# Altium project Powerman.PrjPcb
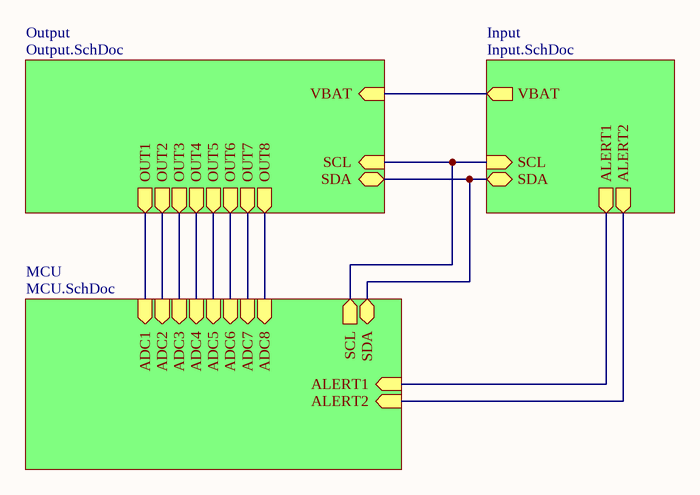
[diagram p0: POWERMAN.SchDoc]
4 sheets, 116 parts. Net scope: hierarchical (ports join the sheet entries above them; power ports are global).
Board file: PCB1.PcbDoc
Sheets:
  POWERMAN.SchDoc
    MCU = MCU.SchDoc
    Output = Output.SchDoc
    Input = Input.SchDoc

## Sheet POWERMAN.SchDoc
size A4; SheetNumber: 1; SheetTotal: 4

### Sub-sheets
Input = Input.SchDoc: ALERT2 (out), ALERT1 (out), VBAT (out), SDA (bidir), SCL (in)
MCU = MCU.SchDoc: ADC1 (in), ADC2 (in), ADC3 (in), ADC4 (in), ADC5 (in), ADC6 (in), ADC7 (in), ADC8 (in), SCL (out), SDA (bidir), ALERT1 (in), ALERT2 (in)
Output = Output.SchDoc: OUT1 (out), OUT2 (out), OUT3 (out), OUT4 (out), OUT5 (out), OUT6 (out), OUT7 (out), OUT8 (out), SCL (in), SDA (bidir), VBAT (in)

### Nets
VCC: sheet Output/VBAT, sheet Input/VBAT
ALERT1: sheet MCU/ALERT1, sheet Input/ALERT1
ALERT2: sheet MCU/ALERT2, sheet Input/ALERT2
SCL: sheet MCU/SCL, sheet Output/SCL, sheet Input/SCL
SDA: sheet MCU/SDA, sheet Output/SDA, sheet Input/SDA
NetU5_4: sheet MCU/ADC1, sheet Output/OUT1
NetU6_4: sheet MCU/ADC2, sheet Output/OUT2
NetU7_4: sheet MCU/ADC3, sheet Output/OUT3
NetU8_4: sheet MCU/ADC4, sheet Output/OUT4
NetU9_4: sheet MCU/ADC5, sheet Output/OUT5
NetU10_4: sheet MCU/ADC6, sheet Output/OUT6
NetU11_4: sheet MCU/ADC7, sheet Output/OUT7
NetU12_4: sheet MCU/ADC8, sheet Output/OUT8

## Sheet MCU.SchDoc
size A4; SheetNumber: 4; SheetTotal: 4
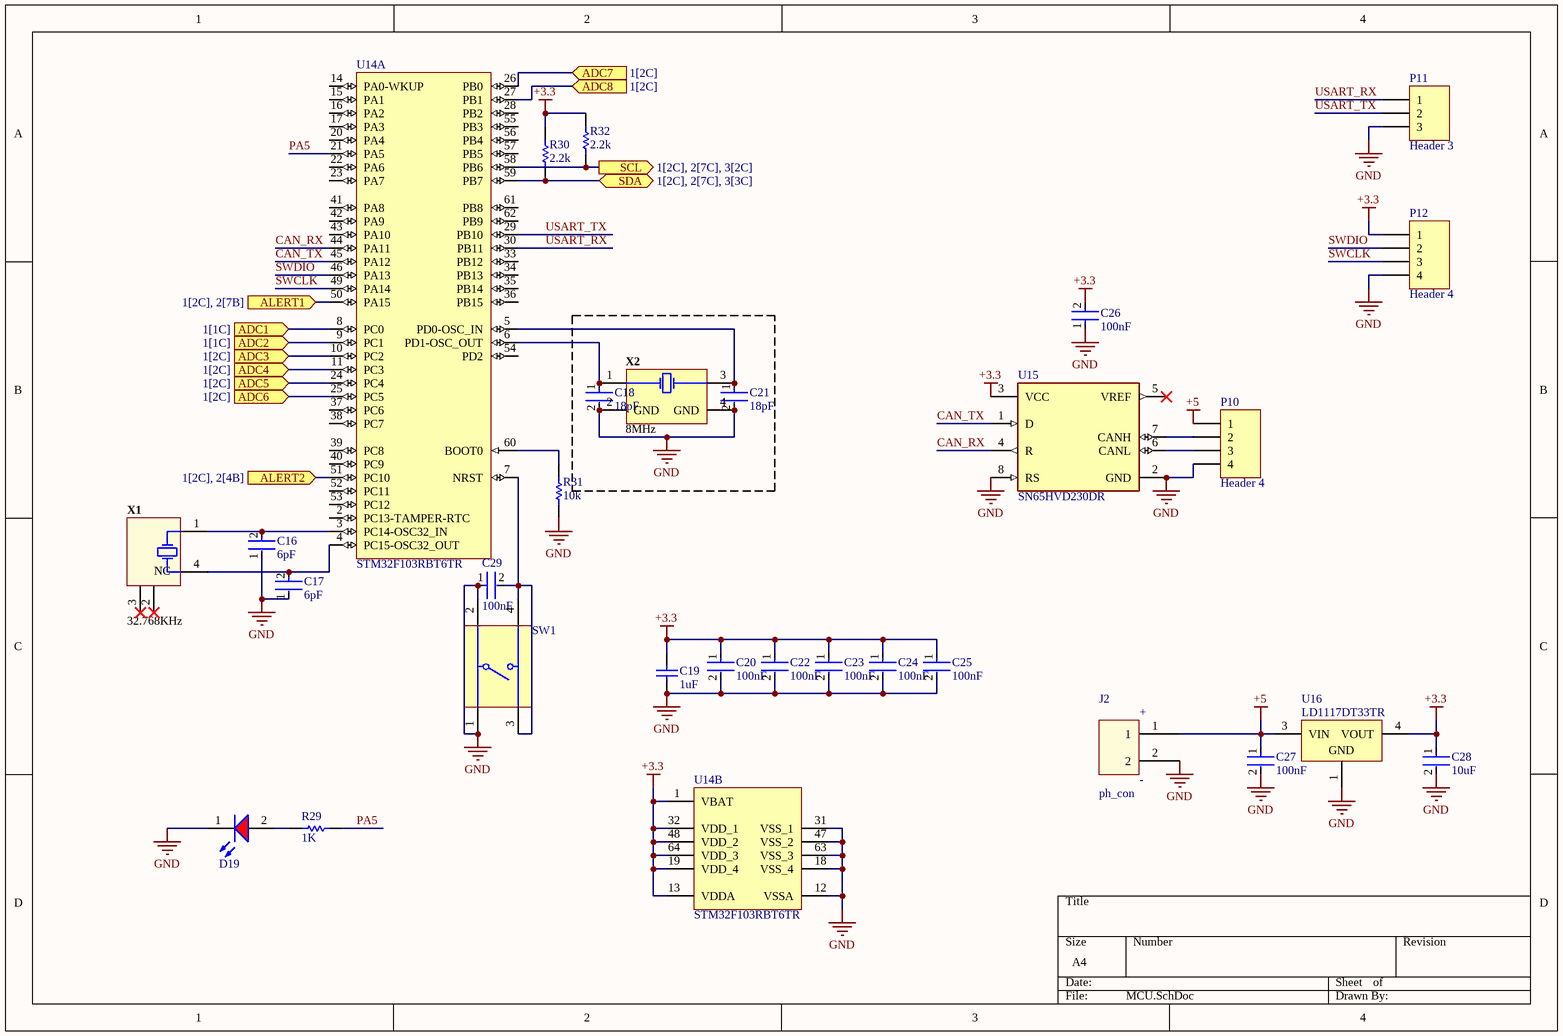
[diagram p1: MCU.SchDoc]

### Parts
C16  6pF  [FP-C1608-080-0_1-IPC_C]
C17  6pF  [FP-C1608-080-0_1-IPC_C]
C18  18pF  [FP-C0603C-CF-MFG]
C19  1uF  [CAPC2013X145X50LL20T25]
C20  100nF  [FP-0805-L_2_01_0_2-W_1_25-IPC_B]
C21  18pF  [FP-C0603C-CF-MFG]
C22  100nF  [FP-0805-L_2_01_0_2-W_1_25-IPC_B]
C23  100nF  [FP-0805-L_2_01_0_2-W_1_25-IPC_B]
C24  100nF  [FP-0805-L_2_01_0_2-W_1_25-IPC_B]
C25  100nF  [FP-0805-L_2_01_0_2-W_1_25-IPC_B]
C26  100nF  [FP-0805-L_2_01_0_2-W_1_25-IPC_B]
C27  100nF  [FP-0805-L_2_01_0_2-W_1_25-IPC_B]
C28  10uF  [FP-C0805C-DG-IPC_B]
C29  100nF  [FP-0805-L_2_01_0_2-W_1_25-IPC_B]
D19  150080SS75000  [WL-SMCW_0805_150080xx75000]  (value not drawn)
J2  ph_con  [Phoenix]
P10  Header 4  [HDR1X4]
P11  Header 3  [HDR1X3]
P12  Header 4  [HDR1X4]
R29  1K  [RESC2013X60X35ML10T20]
R30  2.2k  [RESC2013X60X35ML10T20]
R31  10k  [RESC2013X60X35ML10T20]
R32  2.2k  [RESC2013X60X35ML10T20]
SW1  PTS525SM10SMTRLFS  [CKCP-PTS525SM10SMTR-4_V]  (value not drawn)
U14  STM32F103RBT6TR  [STM-LQFP64_V]  (parts A,B of 2)
U15  SN65HVD230DR  [FP-D0008A-IPC_A]
U16  LD1117DT33TR  [TO-252_M]
X1  32.768KHz  [ABRA-ABS25-4_V]
X2  8MHz  [TXC-7B-4_V]

### Ports
ADC1 (in, see 1[1C]), ADC2 (in, see 1[1C]), ADC3 (in, see 1[2C]), ADC4 (in, see 1[2C]), ADC5 (in, see 1[2C]), ADC6 (in, see 1[2C]), ADC7 (in, see 1[2C]), ADC8 (in, see 1[2C]), ALERT1 (in, see 1[2C], 2[7B]), ALERT2 (in, see 1[2C], 2[4B]), SCL (out, see 1[2C], 2[7C], 3[2C]), SDA (bidir, see 1[2C], 2[7C], 3[3C])

### Nets
+3.3: C19.2 C20.1 C22.1 C23.1 C24.1 C25.1 C26.2 C28.1 P12.1 R30.2 R32.2 U14.1(VBAT) U14.13(VDDA) U14.19(VDD_4) U14.32(VDD_1) U14.48(VDD_2) U14.64(VDD_3) U15.3(VCC) U16.4(VOUT)
+5: C27.1 J2.1 P10.1 U16.3(VIN)
GND: C16.1 C17.1 C18.2 C19.1 C20.2 C21.2 C22.2 C23.2 C24.2 C25.2 C26.1 C27.2 C28.2 C29.1 D19.1(K) J2.2 P10.4 P11.3 P12.4 R31.1 SW1.1 SW1.2 U14.12(VSSA) U14.18(VSS_4) U14.31(VSS_1) U14.47(VSS_2) U14.63(VSS_3) U15.2(GND) U15.8(RS) U16.1(GND) X2.2(GND) X2.4(GND)
ALERT1: U14.50(PA15) ; port ALERT1
ALERT2: U14.51(PC10) ; port ALERT2
CAN_RX: U14.44(PA11) U15.4(R)
CAN_TX: U14.45(PA12) U15.1(D)
PA5: R29.1 U14.21(PA5)
SCL: R32.1 U14.58(PB6) ; port SCL
SDA: R30.1 U14.59(PB7) ; port SDA
SWCLK: P12.3 U14.49(PA14)
SWDIO: P12.2 U14.46(PA13)
USART_RX: P11.1 U14.30(PB11)
USART_TX: P11.2 U14.29(PB10)
NetC16_2: C16.2 U14.3(PC14-OSC32_IN) X1.1(X1)
NetC17_2: C17.2 U14.4(PC15-OSC32_OUT) X1.4(X2)
NetC18_1: C18.1 U14.6(PD1-OSC_OUT) X2.1(X1)
NetC21_1: C21.1 U14.5(PD0-OSC_IN) X2.3(X2)
NetC29_2: C29.2 SW1.3 SW1.4 U14.7(NRST)
NetD19_2: D19.2(A) R29.2
NetP10_2: P10.2 U15.7(CANH)
NetP10_3: P10.3 U15.6(CANL)
NetR31_2: R31.2 U14.60(BOOT0)
NetU5_4: U14.8(PC0) ; port ADC1
NetU6_4: U14.9(PC1) ; port ADC2
NetU7_4: U14.10(PC2) ; port ADC3
NetU8_4: U14.11(PC3) ; port ADC4
NetU9_4: U14.24(PC4) ; port ADC5
NetU10_4: U14.25(PC5) ; port ADC6
NetU11_4: U14.26(PB0) ; port ADC7
NetU12_4: U14.27(PB1) ; port ADC8

Not connected (* = marked no-connect by the designer): U14 2(PC13-TAMPER-RTC) 14(PA0-WKUP) 15(PA1) 16(PA2) 17(PA3) 20(PA4) 22(PA6) 23(PA7) 28(PB2) 33(PB12) 34(PB13) 35(PB14) 36(PB15) 37(PC6) 38(PC7) 39(PC8) 40(PC9) 41(PA8) 42(PA9) 43(PA10) 52(PC11) 53(PC12) 54(PD2) 55(PB3) 56(PB4) 57(PB5) 61(PB8) 62(PB9); U15 5(VREF)*; X1 2(NC)* 3(NC)*

### Notes on the sheet
- (in symbol Connector_2) +; -

### Library data of the parts
C16 C17 = CMP-08246-006295-1: Multilayer Ceramic Capacitors 6pF ±0.25pF 50V C0G SMD 0603; Case Code (Imperial): 0603; Voltage Rating: 50V; Height: 0.8mm; RoHS Compliant: Yes; Voltage Rating (DC): 50V; Dielectric: C0G; Capacitance: 6pF; Termination: SMD/SMT; Case/Package: 0603; Mount: Surface Mount; Dielectric Material: Ceramic; Thickness: 0.037inch; Packaging: Tape and Reel; Max Operating Temperature: 125°C; Min Operating Temperature: -55°C; Weight: 7.1E-05oz; REACH SVHC: No SVHC; Width: 0.031inch; Case Code (Metric): 1608; Construction: Flat; Series: C; Depth: 0.8mm; Package Quantity: 4000; Lead Free: Lead Free; Length: 1.6mm
C18 C21 = CMP-2006-03103-2: CAP CER 18PF 100V 5% NP0 0603; Manufacturer: KEMET; Manufacturer Part Number: C0603C180J1GACTU; Automotive Grade: Grade 1; Temperature Characteristic: C0G; Material: Ceramic; Tolerance: 0.05; Temperature Coefficient: 30ppm/°C; Temperature Range High: +125°C; RoHS: TRUE; Lead Free: Yes; Device Class L1: Passive Components; Mouser Description: Multilayer Ceramic Capacitors MLCC - SMD/SMT 100volts 18pF C0G 5%; Automotive: Yes; Category: Cap; Temperature Range Low: -55°C; Package: C0603C-CF; Digikey Description: CAP CER 18PF 100V 5% NP0 0603; Voltage Rating: 100 V; Value: 18 pF; Device Class L3: Ceramic Capacitors; Temperature: -55°C to +125°C; Capacitance: 18 pF; Octopart: https://octopart.com/c0603c180j1gactu-kemet-9138579; Height: 0.87mm; ComponentLink2URL: https://api.kemet.com/component-edge/download/datasheet/C0603C100J5GACAUTO.pdf; ComponentLink2Description: Datasheet; Device Class L2: Capacitors
C19 = CMP-1036-04746-2: Manufacturer: Kemet; Part Number: C0805C105K4PACTU
C20 C22-C27 C29 = CMP-2007-04174-2: General Purpose Ceramic Capacitor, 0805, 100nF, 10%, X7R, 15%, 100V; Packaging: Tape and Reel; Min Operating Temperature: -55°C; Dielectric Material: Ceramic; Height: 1.4mm; Voltage Rating: 100V; Termination: SMD/SMT; Case Code (Imperial): 0805; Case Code (Metric): 2012; Case/Package: 0805; Construction: Flat; Radiation Hardening: No; Series: -; Dielectric: X7R; Package Quantity: 2000; Mount: Surface Mount; Capacitance: 100nF; Contact Plating: Tin; Voltage: 100V; Lead Free: Lead Free; Depth: 1.25mm; RoHS Compliant: Yes; Number of Pins: 2; Max Operating Temperature: 125°C; Length: 2.01mm; Voltage Rating (DC): 100V; Thickness: 0.055inch; REACH SVHC: No SVHC; Width: 0.049inch; Tolerance: 10%
C28 = CMP-2007-03243-2: CAP CER 10UF 10V X5R 0805; Manufacturer Part Number: C0805C106K8PACTU; Manufacturer: Kemet; 3DS Part Number: 220-00001; Tolerance: 10%; Temperature Coefficient: 15%; Material: Ceramic; Device Class L2: Capacitors; Device Class L1: Passive Components; ComponentLink2URL: https://content.kemet.com/datasheets/KEM_C1006_X5R_SMD.pdf; Height: 1.4mm; Lead Free: Yes; Digikey Description: CAP CER 10UF 10V X5R 0805; Octopart: https://octopart.com/c0805c106k8pactu-kemet-98697; Capacitance: 10uF; Value: 10uF; Temperature Range Low: -55°C; Temperature: -55°C to +85°C; Automotive: No; Mouser Description: CAP CER 10UF 10V X5R 0805; Ipc Land Pattern Name: CAPC200125X125; Temperature Range High: +85°C; Voltage: 10V; RoHS: TRUE; Device Class L3: Ceramic Capacitors; ComponentLink2Description: Datasheet; Voltage Rating: 10V; Package: C0805C-DG; Temperature Characteristic: X5R; Category: Cap
D19 = CMP-1426-00010-3: NexarPartId: 29717782; Peak Wavelength: 645nm; Luminous Intensity: 60mcd; Max Junction Temperature (Tj): 95°C; Wavelength: 630nm; Forward Current: 100mA; Max Reverse Voltage (DC): 5V; Color: Red; Lens Style: Clear, Rectangular; Test Current: 20mA; Power Dissipation: 72mW; Viewing Angle: 140°; Forward Voltage: 1.9V; Case Code (Metric): 2012; Max Operating Temperature: 85°C; Mount: Surface Mount; Height: 700µm; Case/Package: 0805; Min Operating Temperature: -40°C; Reverse Voltage: 5V; RoHS: Compliant; Packaging: Tape and Reel; REACH SVHC: Unknown; Case Code (Imperial): 0805; Length: 2mm; Width: 1.25mm; Dominant Wavelength: 630nm
J2 = Connector_2
P10 P12 = Header 4: Header, 4-Pin; LatestRevisionDate: 17-Jul-2002; LatestRevisionNote: Re-released for DXP Platform.; Publisher: Altium Limited
P11 = Header 3: Header, 3-Pin; LatestRevisionDate: 17-Jul-2002; LatestRevisionNote: Re-released for DXP Platform.; Publisher: Altium Limited
R29 = CMP-2100-03671-1: Chip Resistor, 1 KOhm, +/- 1%, 125 mW, -55 to 155 degC, 0805 (2012 Metric), RoHS, Tape and Reel; Manufacturer: Yageo; Temperature Coefficient: 100ppm/degreesC; Voltage Rating (DC): 150V; Max Power Dissipation: 125mW; Resistance: 1KOhm; Number of Pins: 2; Number of Terminations: 2; Datasheet URL: http://www.yageo.com/NewPortal/yageodocoutput?fileName=/pdf/R-Chip/PYu-RC_Group_51_RoHS_L_5.pdf; Length: 0.079inch; Package Description: 2-Pin Surface Mounted Device, Body 2 x 1.25 mm; Depth: 1.25mm; Height: 0.024inch; Military Standard: Not; Case/Package: 0805; Package Reference: 0805; RoHSCompliant: true; Lead Free: LeadFree; Packaging: TapeandReel; Package Quantity: 1; Datasheet Version: Rev. 5, 10/2016; Tolerance: 1%; Min Operating Temperature: -55degC; Voltage Rating: 150V; Composition: ThickFilm; Case Code (Imperial): 0805; Power Rating: 125mW; Width: 0.049inch; Case Code (Metric): 2012; Manufacturer URL: http://www.yageo.com/; Max Operating Temperature: 155degC; REACH SVHC: Unknown; Termination: SMD/SMT
R30-R32 = CMP-2100-03673-1: Chip Resistor, 0 Ohm, Jumper, +/- 5%, 0.125 W, -55 to 155 degC, 0805 (2012 Metric), RoHS, Tape and Reel; Manufacturer: Yageo; Power Rating: 125mW; Resistance: 0mOhm; Voltage Rating (DC): 150V; Temperature Coefficient: 200ppm/degreesC; Height: 0.5mm; Depth: 1.25mm; Case Code (Imperial): 0805; Lead Free: LeadFree; Military Standard: Not; Package Description: 2-Pin Surface Mounted Device, Body 2 x 1.25 mm; Case Code (Metric): 2012; Composition: ThickFilm; Voltage Rating: 150V; Manufacturer URL: http://www.yageo.com/; Packaging: TapeandReel; Package Reference: 0805; REACH SVHC: Unknown; Tolerance: 5%; Case/Package: 0805; Max Operating Temperature: 155degC; Number of Pins: 2; Min Operating Temperature: -55degC; RoHSCompliant: true; Length: 2mm; Datasheet URL: http://www.yageo.com/NewPortal/yageodocoutput?fileName=/pdf/R-Chip/PYu-RC_Group_51_RoHS_L_5.pdf; Termination: SMD/SMT; Radiation Hardening: No; Width: 1.25mm; Contact Plating: Tin; Datasheet Version: Rev. 5, 10/2016
SW1 = CMP-2000-05088-1: Microminiature Tact Switch, SPST-NO, 50 mA, 12 VDC, -40 to 60 degC, 4-Pin SMD, RoHS, Tape and Reel; Manufacturer: C&K Components; Maximum DC Voltage Rating: 12V; Body Orientation: Straight; Dielectric Strength: 250VAC; Pole Throw Configuration: SPST; Operating Force: 1.57N; Minimum Insulation Resistance: 100000MOhm; Actuator Length: 0.3mm; Base Material: Nylon6/6,Glass/Polyester; Switch Configuration: N.O.; Contact Rating @ Voltage: 0.05@12VDCA; Ground Terminal: No; Mechanical Life: 100000Cycles; Actuator Style: RoundButton; Illumination Type: N/R; Maximum Contact Resistance: 100mOhm; Datasheet Version: Apr-09; Contact Material: PhosphorBronze; Dimension: 5.25x6.4x1.5mm; Family: PTS525; Type: N/A; Seal Description: N/A; Mounting: SurfaceMount,GullWing; Product Weight: N/A; Seal Location: N/A; Electrical Life: N/A; Manufacturer URL: http://www.ckswitches.com/; Part No: PTS525SM10SMTRLFS; Datasheet URL: https://datasheet.ciiva.com/18145/getdatasheetpartid-226915-18145102.pdf; Maximum AC Voltage Rating: N/A; Supplier: C&KComponents; HTS: 8536501199; Contact Plating: SilverClad; Actuator Color: N/A; Operating Temperature: -40to60C; ECCN: EAR99; Supplier Standard Pack: 3,000; RoHS: Yes; Housing Material: N/A; Packaging: TapeandReel
U14 = CMP-0237-00169-4: ARM Cortex-M3 32-bit MCU, 128 KB Flash, 20 KB Internal RAM, 51 I/Os, 64-pin LQFP, -40 to 85 degC, Tape and Reel; Operating Frequency(F) (Processor speed) (MHz): 72; Internal RAM Size (kB): 20; I/Os (High Current): 51; FLASH Size (Prog) (kB): 128; Supply Voltage(Vcc) min (V): 2; A/D Converter: 2x12-bit (16 Channel); ComponentLink3URL: http://www.st.com/st-web-ui/static/active/en/resource/technical/document/datasheet/DM00037051.pdf; ComponentLink2Description: Datasheet; PackageDescription: 64-Pin Low Profile Quad Flat Package, 10 x 10 mm Body, 0.5 mm Pitch; ComponentLink3Description: Package Specification; Mounting Technology: Surface Mount; ComponentLink1Description: Manufacturer URL; DatasheetVersion: Rev. 16; PackageReference: LQFP64; PartNumber: STM32F103RBT6TR; Core: ARM Cortex-M3; ComponentLink2URL: http://www.st.com/st-web-ui/static/active/en/resource/technical/document/datasheet/CD00161566.pdf; ComponentLink1URL: http://www.st.com/web/en/home.html; PackageVersion: Rev. 4, 06/2013; Packing: Tape and Reel
U15 = CMP-0315-00015-3: IC TRANSCEIVER HALF 1/1 8SOIC; Number of Transceivers: 1; Operating Supply Voltage: 3.3V; Number of I/Os: 2; Max Supply Current: 17mA; Max Supply Voltage: 3.6V; Min Supply Voltage: 3V; Data Rate: 1Mbps; Min Operating Temperature: -40°C; Packaging: Tape and Reel; Lead Free: Lead Free; Number of Transmit Buffers: 1; Max Operating Temperature: 85°C; Number of Receive Buffers: 1; Number of Pins: 8; Package Quantity: 1; Radiation Hardening: No; Case/Package: D; REACH SVHC: No SVHC; Weight: 0.002561oz; Termination: SMD/SMT; Contact Plating: Gold; Nominal Supply Current: 17mA; Number of Receivers: 1; Number of Drivers: 1
U16 = CMP-0244-00088-1: Fixed Low Drop Positive Voltage Regulator, 3.3V, 3-Pin DPAK, Tape and Reel; ComponentLink1Description: Manufacturer URL; PackageVersion: 2011; PackageReference: TO-252; ComponentLink2Description: Datasheet; ComponentLink1URL: http://www.st.com; DatasheetVersion: 1/11/2011; PackageDescription: 3-Pin Transistor Outline Package 2.28 mm Pitch, 9.7 mm Lead Span (DPAK); ComponentLink2URL: http://www.st.com/internet/com/TECHNICAL_RESOURCES/TECHNICAL_LITERATURE/DATASHEET/CD00000544.pdf
X1 = CMP-2000-05036-1: Low Frequency Crystal, 32.768 KHz, 6 pF, +/- 20 ppm, -40 to 85 degC, 4-Pin SMD, RoHS, Tape and Reel; Manufacturer: Abracon; Tolerance: 20PPM; ESR: 50kOhms; Case Width: 3.8mm; Case Height: 2.5mm; Case Length: 8mm; Load Capacitance: 6pF; Operating Temperature Range: -40Cto+85C; Package Reference: ABS25; Factory Pack Quantity: 3000; Package Description: 4-Pin Surface Mount Device, Body 8 x 3.8 mm, Pitch 5.5 mm; Frequency: 32.768kHz; Termination Style: SMD/SMT; Manufacturer URL: http://www.abracon.com/; Type: LowFrequencyCrystal; Dimensions: 3.8mmWx8mmLx2.5mmH; Product Category: Crystals; Series: ABS25; RoHS: Details; Package / Case: 8mmx3.8mm; Datasheet Version: Jun-17; Brand: ABRACON; Datasheet URL: https://datasheet.ciiva.com/854/abs25-854528.pdf; Packaging: Reel; Mounting Style: SMD/SMT
X2 = CMP-1774-00004-1: SMD Seam Sealing Crystal, 8 MHz, +/- 30 ppm, 18 pF, -10 to 70 degC, 4-Pin SMD, RoHS, Tape and Reel; Power Rating: 100 mW; Case\Package: 0603; Voltage Rating: 50 V; Tolerance: 1%; Resistance: 150 Ohm; Package Quantity: 5000; Case Code (Metric): 1608; Packaging: Tape and Reel; Length: 1.6 mm; RoHSCompliant: true; REACH SVHC: No SVHC; Mount: Surface Mount; Case Code (Imperial): 0603; Pins: 2; Width: 0.8 mm; PackageDescription: 4-Pin Surface Mount Device, Body 5 x 3.2 mm, Pitch 3.7 mm; ComponentLink1Description: Datasheet; DatasheetVersion: Jul-15; ComponentLink1URL: http://www.txccorp.com/download/products/quartz_crystals/2015TXC_7B_19.pdf; PackageReference: 7B-4; Height: 0.45 mm; Max Operating Temperature: 155 degC; Min Operating Temperature: -55 degC; Voltage Rating (DC): 50 V

## Sheet Output.SchDoc
size A3; SheetNumber: 3; SheetTotal: 4
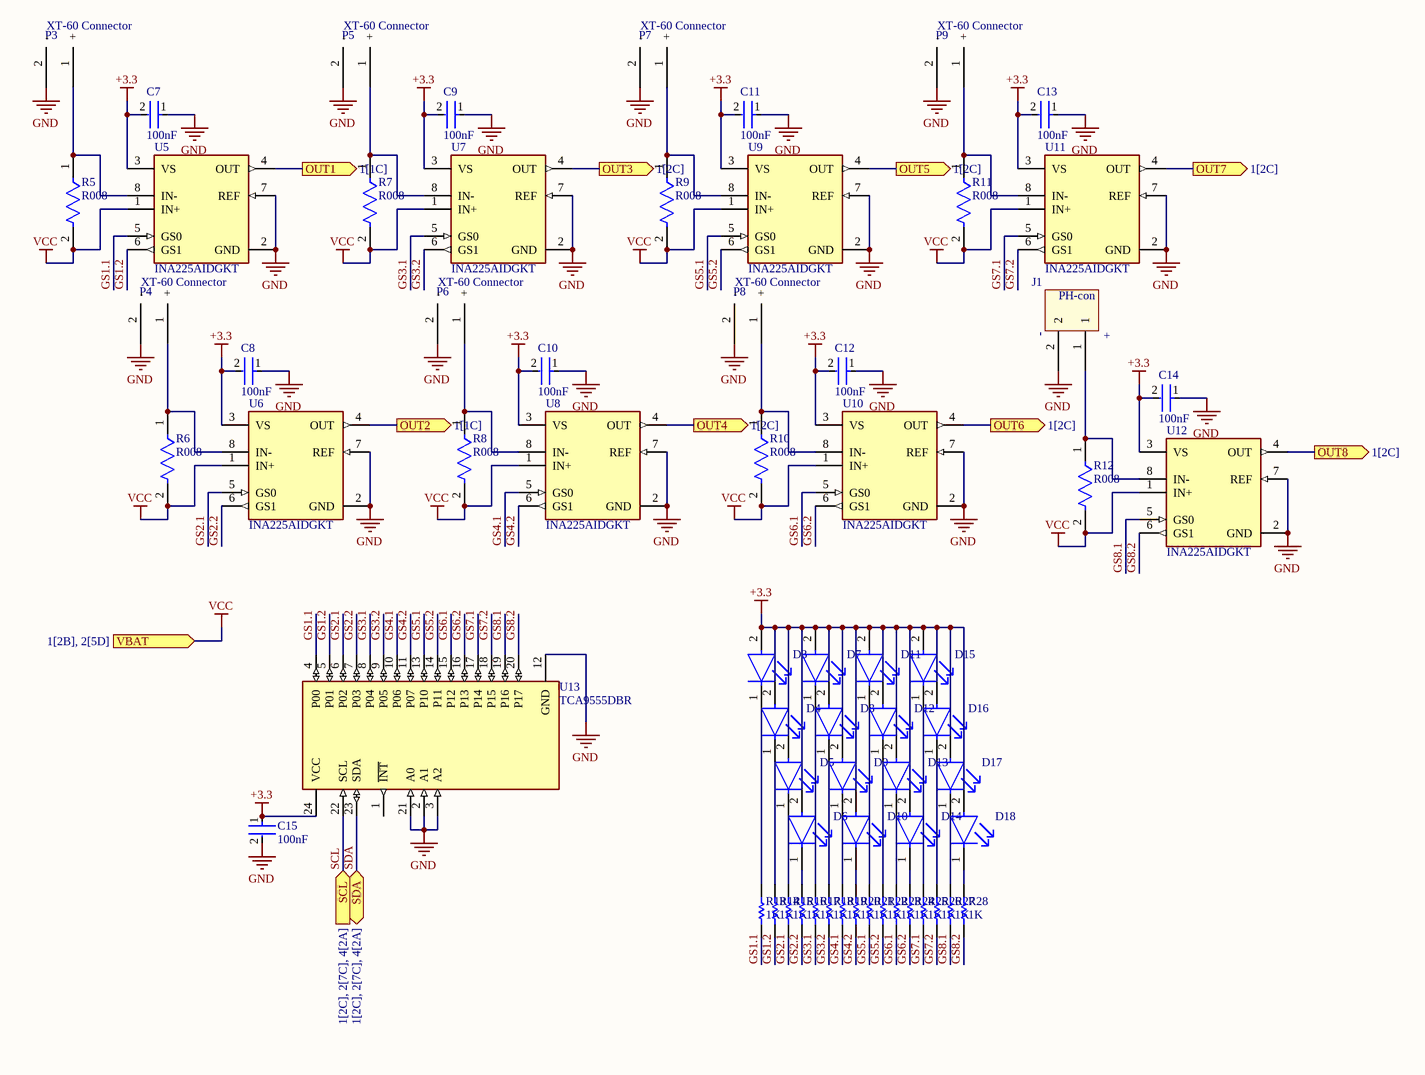
[diagram p2: Output.SchDoc]

### Parts
C7  100nF  [FP-0805-L_2_01_0_2-W_1_25-IPC_B]
C8  100nF  [FP-0805-L_2_01_0_2-W_1_25-IPC_B]
C9  100nF  [FP-0805-L_2_01_0_2-W_1_25-IPC_B]
C10  100nF  [FP-0805-L_2_01_0_2-W_1_25-IPC_B]
C11  100nF  [FP-0805-L_2_01_0_2-W_1_25-IPC_B]
C12  100nF  [FP-0805-L_2_01_0_2-W_1_25-IPC_B]
C13  100nF  [FP-0805-L_2_01_0_2-W_1_25-IPC_B]
C14  100nF  [FP-0805-L_2_01_0_2-W_1_25-IPC_B]
C15  100nF  [FP-0805-L_2_01_0_2-W_1_25-IPC_B]
D3  TLLG4401  [FP-6_544-5255_01-4-MFG]  (value not drawn)
D4  TLLG4401  [FP-6_544-5255_01-4-MFG]  (value not drawn)
D5  TLLG4401  [FP-6_544-5255_01-4-MFG]  (value not drawn)
D6  TLLG4401  [FP-6_544-5255_01-4-MFG]  (value not drawn)
D7  TLLG4401  [FP-6_544-5255_01-4-MFG]  (value not drawn)
D8  TLLG4401  [FP-6_544-5255_01-4-MFG]  (value not drawn)
D9  TLLG4401  [FP-6_544-5255_01-4-MFG]  (value not drawn)
D10  TLLG4401  [FP-6_544-5255_01-4-MFG]  (value not drawn)
D11  TLLG4401  [FP-6_544-5255_01-4-MFG]  (value not drawn)
D12  TLLG4401  [FP-6_544-5255_01-4-MFG]  (value not drawn)
D13  TLLG4401  [FP-6_544-5255_01-4-MFG]  (value not drawn)
D14  TLLG4401  [FP-6_544-5255_01-4-MFG]  (value not drawn)
D15  TLLG4401  [FP-6_544-5255_01-4-MFG]  (value not drawn)
D16  TLLG4401  [FP-6_544-5255_01-4-MFG]  (value not drawn)
D17  TLLG4401  [FP-6_544-5255_01-4-MFG]  (value not drawn)
D18  TLLG4401  [FP-6_544-5255_01-4-MFG]  (value not drawn)
J1  PH-con  [Phoenix]
P3  XT-60 Connector  [2]
P4  XT-60 Connector  [2]
P5  XT-60 Connector  [2]
P6  XT-60 Connector  [2]
P7  XT-60 Connector  [2]
P8  XT-60 Connector  [2]
P9  XT-60 Connector  [2]
R5  R008  [FP-RL2512-MFG]
R6  R008  [FP-RL2512-MFG]
R7  R008  [FP-RL2512-MFG]
R8  R008  [FP-RL2512-MFG]
R9  R008  [FP-RL2512-MFG]
R10  R008  [FP-RL2512-MFG]
R11  R008  [FP-RL2512-MFG]
R12  R008  [FP-RL2512-MFG]
R13  1K  [RESC2013X60X35ML10T20]
R14  1K  [RESC2013X60X35ML10T20]
R15  1K  [RESC2013X60X35ML10T20]
R16  1K  [RESC2013X60X35ML10T20]
R17  1K  [RESC2013X60X35ML10T20]
R18  1K  [RESC2013X60X35ML10T20]
R19  1K  [RESC2013X60X35ML10T20]
R20  1K  [RESC2013X60X35ML10T20]
R21  1K  [RESC2013X60X35ML10T20]
R22  1K  [RESC2013X60X35ML10T20]
R23  1K  [RESC2013X60X35ML10T20]
R24  1K  [RESC2013X60X35ML10T20]
R25  1K  [RESC2013X60X35ML10T20]
R26  1K  [RESC2013X60X35ML10T20]
R27  1K  [RESC2013X60X35ML10T20]
R28  1K  [RESC2013X60X35ML10T20]
U5  INA225AIDGKT  [FP-INA225AIDGKT-IPC_A]
U6  INA225AIDGKT  [FP-INA225AIDGKT-IPC_A]
U7  INA225AIDGKT  [FP-INA225AIDGKT-IPC_A]
U8  INA225AIDGKT  [FP-INA225AIDGKT-IPC_A]
U9  INA225AIDGKT  [FP-INA225AIDGKT-IPC_A]
U10  INA225AIDGKT  [FP-INA225AIDGKT-IPC_A]
U11  INA225AIDGKT  [FP-INA225AIDGKT-IPC_A]
U12  INA225AIDGKT  [FP-INA225AIDGKT-IPC_A]
U13  TCA9555DBR  [FP-DB0024A-IPC_A]

### Ports
OUT1 (out, see 1[1C]), OUT2 (out, see 1[1C]), OUT3 (out, see 1[2C]), OUT4 (out, see 1[2C]), OUT5 (out, see 1[2C]), OUT6 (out, see 1[2C]), OUT7 (out, see 1[2C]), OUT8 (out, see 1[2C]), SCL (in, see 1[2C], 2[7C], 4[2A]), SDA (bidir, see 1[2C], 2[7C], 4[2A]), VBAT (in, see 1[2B], 2[5D])

### Nets
+3.3: C7.2 C8.2 C9.2 C10.2 C11.2 C12.2 C13.2 C14.2 C15.1 D3.2(A) D4.2(A) D5.2(A) D6.2(A) D7.2(A) D8.2(A) D9.2(A) D10.2(A) D11.2(A) D12.2(A) D13.2(A) D14.2(A) D15.2(A) D16.2(A) D17.2(A) D18.2(A) U5.3(VS) U6.3(VS) U7.3(VS) U8.3(VS) U9.3(VS) U10.3(VS) U11.3(VS) U12.3(VS) U13.24(VCC)
GND: C7.1 C8.1 C9.1 C10.1 C11.1 C12.1 C13.1 C14.1 C15.2 J1.2 P3.2(-) P4.2(-) P5.2(-) P6.2(-) P7.2(-) P8.2(-) P9.2(-) U5.2(GND) U5.7(REF) U6.2(GND) U6.7(REF) U7.2(GND) U7.7(REF) U8.2(GND) U8.7(REF) U9.2(GND) U9.7(REF) U10.2(GND) U10.7(REF) U11.2(GND) U11.7(REF) U12.2(GND) U12.7(REF) U13.2(A1) U13.3(A2) U13.12(GND) U13.21(A0)
VCC: R5.2 R6.2 R7.2 R8.2 R9.2 R10.2 R11.2 R12.2 U5.1(IN+) U6.1(IN+) U7.1(IN+) U8.1(IN+) U9.1(IN+) U10.1(IN+) U11.1(IN+) U12.1(IN+) ; port VBAT
GS1.1: R13.1 U5.5(GS0) U13.4(P00)
GS1.2: R14.1 U5.6(GS1) U13.5(P01)
GS2.1: R15.1 U6.5(GS0) U13.6(P02)
GS2.2: R16.1 U6.6(GS1) U13.7(P03)
GS3.1: R17.1 U7.5(GS0) U13.8(P04)
GS3.2: R18.1 U7.6(GS1) U13.9(P05)
GS4.1: R19.1 U8.5(GS0) U13.10(P06)
GS4.2: R20.1 U8.6(GS1) U13.11(P07)
GS5.1: R21.1 U9.5(GS0) U13.13(P10)
GS5.2: R22.1 U9.6(GS1) U13.14(P11)
GS6.1: R23.1 U10.5(GS0) U13.15(P12)
GS6.2: R24.1 U10.6(GS1) U13.16(P13)
GS7.1: R25.1 U11.5(GS0) U13.17(P14)
GS7.2: R26.1 U11.6(GS1) U13.18(P15)
GS8.1: R27.1 U12.5(GS0) U13.19(P16)
GS8.2: R28.1 U12.6(GS1) U13.20(P17)
SCL: U13.22(SCL) ; port SCL
SDA: U13.23(SDA) ; port SDA
NetD3_1: D3.1(C) R13.2
NetD4_1: D4.1(C) R14.2
NetD5_1: D5.1(C) R15.2
NetD6_1: D6.1(C) R16.2
NetD7_1: D7.1(C) R17.2
NetD8_1: D8.1(C) R18.2
NetD9_1: D9.1(C) R19.2
NetD10_1: D10.1(C) R20.2
NetD11_1: D11.1(C) R21.2
NetD12_1: D12.1(C) R22.2
NetD13_1: D13.1(C) R23.2
NetD14_1: D14.1(C) R24.2
NetD15_1: D15.1(C) R25.2
NetD16_1: D16.1(C) R26.2
NetD17_1: D17.1(C) R27.2
NetD18_1: D18.1(C) R28.2
NetJ1_1: J1.1 R12.1 U12.8(IN-)
NetP3_1: P3.1(+) R5.1 U5.8(IN-)
NetP4_1: P4.1(+) R6.1 U6.8(IN-)
NetP5_1: P5.1(+) R7.1 U7.8(IN-)
NetP6_1: P6.1(+) R8.1 U8.8(IN-)
NetP7_1: P7.1(+) R9.1 U9.8(IN-)
NetP8_1: P8.1(+) R10.1 U10.8(IN-)
NetP9_1: P9.1(+) R11.1 U11.8(IN-)
NetU5_4: U5.4(OUT) ; port OUT1
NetU6_4: U6.4(OUT) ; port OUT2
NetU7_4: U7.4(OUT) ; port OUT3
NetU8_4: U8.4(OUT) ; port OUT4
NetU9_4: U9.4(OUT) ; port OUT5
NetU10_4: U10.4(OUT) ; port OUT6
NetU11_4: U11.4(OUT) ; port OUT7
NetU12_4: U12.4(OUT) ; port OUT8

Not connected (* = marked no-connect by the designer): U13 1(~{INT})

### Notes on the sheet
- (in symbol Connector_2) -; +

### Library data of the parts
C7-C15 = CMP-2007-04174-2: as C20 on sheet MCU; Packaging: Tape and Reel; Min Operating Temperature: -55°C; Dielectric Material: Ceramic; Height: 1.4mm; Voltage Rating: 100V; Termination: SMD/SMT; Case Code (Imperial): 0805; Case Code (Metric): 2012; Case/Package: 0805; Construction: Flat; Radiation Hardening: No; Series: -; Dielectric: X7R; Package Quantity: 2000; Mount: Surface Mount; Capacitance: 100nF; Contact Plating: Tin; Voltage: 100V; Lead Free: Lead Free; Depth: 1.25mm; RoHS Compliant: Yes; Number of Pins: 2; Max Operating Temperature: 125°C; Length: 2.01mm; Voltage Rating (DC): 100V; Thickness: 0.055inch; REACH SVHC: No SVHC; Width: 0.049inch; Tolerance: 10%
D3-D18 = CMP-00030-39390728-1: TLLG4401 LED, Green, 2mcd, 3mmDia., T-1, +/-25deg, 565nm, 7mA, 1.9V Vf, 20V Vr, 20mW, -40; Test Current: 2mA; Wavelength: 575nm; Number of Elements: 1; Viewing Angle: 25°; Lens Transparency: Diffused; Voltage Rating (DC): 2.4V; Lead Length: 23mm; Max Junction Temperature (Tj): 100°C; Lens Style: Circular, Colored, Diffused, Dome, Round, Tinted; Reverse Voltage: 6V; Forward Voltage: 1.9V; Length: 3.2mm; Forward Current: 2mA; Color: Green; Dominant Wavelength: 575nm; Radiation Hardening: No; NexarPartId: 39390728; Lens Color: Green; REACH SVHC: Unknown; Lead Free: Lead Free; Number of Pins: 2; Luminous Intensity: 2mcd; Schedule B: 8541402000, 8541402000; Max Operating Temperature: 100°C; Illumination Color: Green; Mount: Through Hole; Packaging: Bulk; Depth: 3.2mm; Ambient Temperature Range High: 100°C; Case/Package: Radial; Power Dissipation: 20mW; Height: 4.5mm; RoHS: Compliant; Peak Wavelength: 565nm; Min Operating Temperature: -40°C; Number of LEDs: 1
J1 = Connector_2
P3-P9 = XT-60 Connector: Manufacturer: POLOLU; Manufacturer Part Number: XT60 YELLOW; Unit: pcs; SuppliedAmount: 0; MinAmount: 1; Type of robotics accessories: power connector; Maximum current: 65A; Information: Product is not a working device, but only component; Supplier 1: TME; Category: Power Supply Modules; Stock 1: 29; Pricing 1: 1=2.08, 10=1.95 (USD); Weight: 7.267; Multiples: 1; Number of pins: 2; Colour: yellow; Price Type: NET; ComponentLink1URL: http://static.tme.eu/products_pics/8/b/5/8b5040a8a5baf3e0e67386c2e3a9b903/913.jpg; ComponentLink1Description: http://static.tme.eu/products_pics/8/b/5/8b5040a8a5baf3e0e67386c2e3a9b903/913.jpg; Supplier Part Number 1: XT-60 Connector
R5-R12 = CMP-03412-013102-1: RES 0.1 OHM 1% 1W 2512; Manufacturer: YAGEO; Manufacturer Part Number: RL2512FK-070R1L; Automotive Grade: Grade 0; Temperature Coefficient: 600ppm/°C; Value: 100mΩ; Lead Free: Yes; Package: RL2512; Temperature Range High: +155°C; Octopart: https://octopart.com/rl2512fk-070r1l-yageo-42334369; Composition: Thick Film; Height: 0.65mm; ComponentLink2URL: http://www.yageo.com/documents/recent/PYu-RL_Group_521_RoHS_L_2.pdf; Device Class L3: Chip SMD Resistors; Automotive: Yes; Series: RL; Device Class L1: Passive Components; Device Class L2: Resistors; Mouser Description: Current Sense Resistors 0.1ohm 1% 1W; Temperature: -55°C to +155°C; ComponentLink2Description: Datasheet; Footprint Url: http://www.yageo.com/exep/pages/download/literatures/PYu-R_Mount_10.pdf; Ipc Land Pattern Name: RESC635320X55; RoHS: TRUE; Category: Res; Temperature Range Low: -55°C; Power Rating: 1W; Tolerance: 1%; Resistance: 100mΩ; Digikey Description: RES 0.1 OHM 1% 1W 2512
R13-R28 = CMP-2100-03671-1: as R29 on sheet MCU; Number of Pins: 2; Number of Terminations: 2; Datasheet URL: http://www.yageo.com/NewPortal/yageodocoutput?fileName=/pdf/R-Chip/PYu-RC_Group_51_RoHS_L_5.pdf; Length: 0.079inch; Package Description: 2-Pin Surface Mounted Device, Body 2 x 1.25 mm; Depth: 1.25mm; Height: 0.024inch; Military Standard: Not; Case/Package: 0805; Package Reference: 0805; RoHSCompliant: true; Lead Free: LeadFree; Packaging: TapeandReel; Package Quantity: 1; Datasheet Version: Rev. 5, 10/2016; Tolerance: 1%; Min Operating Temperature: -55degC; Voltage Rating: 150V; Composition: ThickFilm; Case Code (Imperial): 0805; Power Rating: 125mW; Width: 0.049inch; Case Code (Metric): 2012; Manufacturer URL: http://www.yageo.com/; Max Operating Temperature: 155degC; REACH SVHC: Unknown; Termination: SMD/SMT
U5-U12 = CMP-04895-000038-1: IC MONITOR PWR/CUR BIDIR 8VSSOP; Manufacturer: Texas Instruments; Nominal Supply Current: 300uA; Input Bias Current: 72uA; Bandwidth: 250kHz; Number Of Channels: 1; Voltage Gain: 0.025/0.05/0.1/0.2V/mV; Standoff Height: 0.05mm; Min Supply Voltage: 2.7V; Input Offset Voltage: 0.075mV; Max Junction Temp: +150°C; Max Supply Voltage: 36V; Ipc Land Pattern Name: SOIC65P490X110-8; Device Class L2: Linear ICs; Automotive: No; Ambient Temperature Range Low: -40°C; Octopart: https://octopart.com/ina225aidgkt-texas+instruments-28946314; Ambient Temperature Range High: +125°C; RoHS: TRUE; Height: 1.1mm; Temperature Range High: +125°C; Package: VSSOP8; Temperature Range Low: -40°C; Temperature: -40°C to +125°C; Lead Free: Yes; Digikey Description: IC MONITOR PWR/CUR BIDIR 8VSSOP; Device Class L1: Integrated Circuits (ICs); Mouser Description: Current Sense Amplifiers 36V Bidir 0-Drift Ser Crnt-Shunt Mon; Device Class L3: Instrumentation; Manufacturer Part Number: INA225AIDGKT; Category: IC; ComponentLink2Description: Datasheet; ComponentLink2URL: http://www.ti.com/lit/ds/symlink/ina225.pdf
U13 = CMP-04886-000014-1: IC I/O EXPANDER 16B 24SSOP; Interface: I2C; Max Supply Voltage: 5.5V; Number of I/Os: 16; Min Supply Voltage: 1.65V; RoHS Compliant: Yes; Case/Package: SSOP; Min Operating Temperature: -40°C; Packaging: Cut Tape; Max Operating Temperature: 85°C; Lead Free: Lead Free; Number of Pins: 24

## Sheet Input.SchDoc
size A3; SheetNumber: 2; SheetTotal: 4
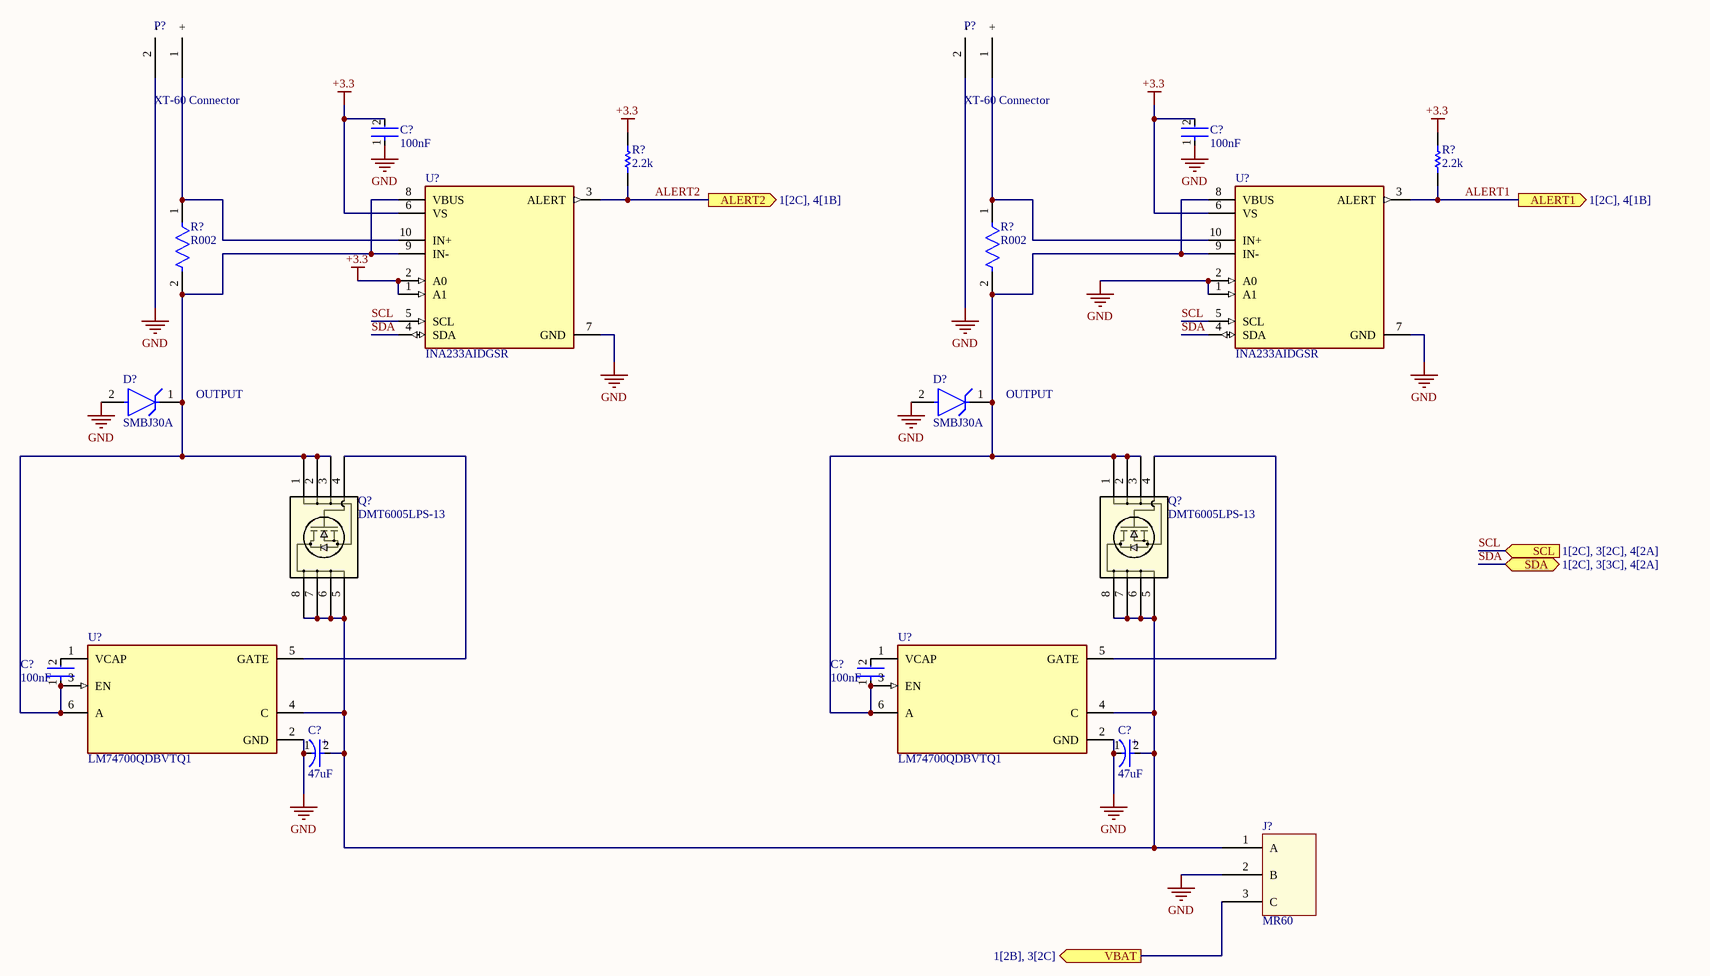
[diagram p3: Input.SchDoc]

### Parts
(Parts that share a designator on the sheet are numbered #1, #2 ... from top to bottom, then left to right.)
C?#1  100nF  [FP-0805-L_2_01_0_2-W_1_25-IPC_B]
C?#2  100nF  [FP-0805-L_2_01_0_2-W_1_25-IPC_B]
C?#3  100nF  [FP-0805-L_2_01_0_2-W_1_25-IPC_B]
C?#4  100nF  [FP-0805-L_2_01_0_2-W_1_25-IPC_B]
C?#5  47uF  [FP-SEV8X10_5-MFG]
C?#6  47uF  [FP-SEV8X10_5-MFG]
D?#1  SMBJ30A  [FP-SMBJ30A-E3-52-0]
D?#2  SMBJ30A  [FP-SMBJ30A-E3-52-0]
J?  MR60  [PCBComponent_1]
P?#1  XT-60 Connector  [2]
P?#2  XT-60 Connector  [2]
Q?#1  DMT6005LPS-13  [POWERDI5060-8_DIO-M]
Q?#2  DMT6005LPS-13  [POWERDI5060-8_DIO-M]
R?#1  2.2k  [RESC2013X60X35ML10T20]
R?#2  2.2k  [RESC2013X60X35ML10T20]
R?#3  R002  [FP-RL2512-MFG]
R?#4  R002  [FP-RL2512-MFG]
U?#1  INA233AIDGSR  [FP-DGS0010A-MFG]
U?#2  INA233AIDGSR  [FP-DGS0010A-MFG]
U?#3  LM74700QDBVTQ1  [FP-DBV0006A-MFG]
U?#4  LM74700QDBVTQ1  [FP-DBV0006A-MFG]

### Ports
ALERT1 (out, see 1[2C], 4[1B]), ALERT2 (out, see 1[2C], 4[1B]), SCL (in, see 1[2C], 3[2C], 4[2A]), SDA (bidir, see 1[2C], 3[3C], 4[2A]), VBAT (out, see 1[2B], 3[2C])

### Nets
+3.3: C?#1.2 C?#2.2 R?#1.2 R?#2.2 U?#1.1(A1) U?#1.2(A0) U?#1.6(VS) U?#2.6(VS)
GND: C?#1.1 C?#2.1 C?#5.1(C) C?#6.1(C) D?#1.2(A) D?#2.2(A) J?.2(B) P?#1.2(-) P?#2.2(-) U?#1.7(GND) U?#2.1(A1) U?#2.2(A0) U?#2.7(GND) U?#3.2(GND) U?#4.2(GND)
VCC: J?.3(C) ; port VBAT
ALERT1: R?#2.1 U?#2.3(ALERT) ; port ALERT1
ALERT2: R?#1.1 U?#1.3(ALERT) ; port ALERT2
SCL: U?#1.5(SCL) U?#2.5(SCL) ; port SCL
SDA: U?#1.4(SDA) U?#2.4(SDA) ; port SDA
NetC?#3_1: C?#3.1 D?#1.1(C) Q?#1.1 Q?#1.2 Q?#1.3 R?#3.2 U?#1.8(VBUS) U?#1.9(IN-) U?#3.3(EN) U?#3.6(A)
NetC?#3_2: C?#3.2 U?#3.1(VCAP)
NetC?#4_1: C?#4.1 D?#2.1(C) Q?#2.1 Q?#2.2 Q?#2.3 R?#4.2 U?#2.8(VBUS) U?#2.9(IN-) U?#4.3(EN) U?#4.6(A)
NetC?#4_2: C?#4.2 U?#4.1(VCAP)
NetC?#5_2: C?#5.2(A) C?#6.2(A) J?.1(A) Q?#1.5 Q?#1.6 Q?#1.7 Q?#1.8 Q?#2.5 Q?#2.6 Q?#2.7 Q?#2.8 U?#3.4(C) U?#4.4(C)
NetP?#1_1: P?#1.1(+) R?#3.1 U?#1.10(IN+)
NetP?#2_1: P?#2.1(+) R?#4.1 U?#2.10(IN+)
NetQ?#1_4: Q?#1.4 U?#3.5(GATE)
NetQ?#2_4: Q?#2.4 U?#4.5(GATE)

### Notes on the sheet
- (near D?#1) OUTPUT
- (near D?#2) OUTPUT
- (in symbol CMP-35376-000024-1) +

### Library data of the parts
C?#1-C?#4 = CMP-2007-04174-2: as C20 on sheet MCU; Packaging: Tape and Reel; Min Operating Temperature: -55°C; Dielectric Material: Ceramic; Height: 1.4mm; Voltage Rating: 100V; Termination: SMD/SMT; Case Code (Imperial): 0805; Case Code (Metric): 2012; Case/Package: 0805; Construction: Flat; Radiation Hardening: No; Series: -; Dielectric: X7R; Package Quantity: 2000; Mount: Surface Mount; Capacitance: 100nF; Contact Plating: Tin; Voltage: 100V; Lead Free: Lead Free; Depth: 1.25mm; RoHS Compliant: Yes; Number of Pins: 2; Max Operating Temperature: 125°C; Length: 2.01mm; Voltage Rating (DC): 100V; Thickness: 0.055inch; REACH SVHC: No SVHC; Width: 0.049inch; Tolerance: 10%
C?#5 C?#6 = CMP-35376-000024-1: CAP ALUM 47UF 20% 50V SMD; Polarity: Polar; Life (Hours): 2000Hour; Ripple Current: 240mA; Case/Package: Radial; Package Quantity: 1; Voltage Rating: 50V; Min Operating Temperature: -40°C; Capacitance: 47uF; Lead Pitch: 3.1mm; Height - Seated (Max): 0.413inch; Ratings: AEC-Q200; Lead Free: Lead Free; Construction: Cylindrical; Max Operating Temperature: 85°C; Packaging: Tape and Reel; RoHS Compliant: Yes; Mount: Surface Mount; Radiation Hardening: No; Tolerance: 20%; Series: SEV
D?#1 D?#2 = CMP-02577-000026-1: TVS DIODE 30VWM 48.4VC DO214AA; Polarity: Unidirectional; Clamping Voltage: 48.4V; Element Configuration: Single; Leakage Current: 1uA; Min Breakdown Voltage: 33.3V; Peak Pulse Power: 600W; Max Breakdown Voltage: 36.8V; Test Current: 1mA; Max Surge Current: 12.4A; Number of Unidirectional Channels: 1; Power Line Protection: No; Diode Type: ZENER; Operating Supply Voltage: 30V; Max Operating Temperature: 150°C; Number of Pins: 2; Series: TransZorb®; Min Operating Temperature: -55°C; Package Quantity: 750; Mount: Surface Mount; Resistor Type: Zener; Clamping Voltage-Max: 48.4V; Packaging: Tape and Reel; Length: 4.57mm; Direction: Unidirectional; Termination: SMD/SMT; Reverse Breakdown Voltage: 33.3V; Peak Pulse Current: 12.4A; Lead Free: Lead Free; Height: 2.24mm; RoHS Compliant: Yes; Breakdown Voltage: 36.8V; Max Power Dissipation: 600W; Power Dissipation: 600W; Max Reverse Leakage Current: 1uA; Reverse Standoff Voltage: 30V; Number of Channels: 1; Case/Package: DO-214AA; Width: 3.94mm; Number of Elements: 1; Radiation Hardening: No
J? = Component_1
P?#1 P?#2 = XT-60 Connector: as P3 on sheet Output; Supplier 1: TME; Category: Power Supply Modules; Stock 1: 29; Pricing 1: 1=2.08, 10=1.95 (USD); Weight: 7.267; Multiples: 1; Number of pins: 2; Colour: yellow; Price Type: NET; ComponentLink1URL: http://static.tme.eu/products_pics/8/b/5/8b5040a8a5baf3e0e67386c2e3a9b903/913.jpg; ComponentLink1Description: http://static.tme.eu/products_pics/8/b/5/8b5040a8a5baf3e0e67386c2e3a9b903/913.jpg; Supplier Part Number 1: XT-60 Connector
Q?#1 Q?#2 = DMT6005LPS-13: No Description Available; Mfr_Name: Diodes Inc; Type: DEV; Copyright: Copyright (C) 2023 Ultra Librarian. All rights reserved.; Manufacturer_Part_Number: DMT6005LPS-13; RefDes: RefDes
R?#1 R?#2 = CMP-2100-03673-1: as R30 on sheet MCU; Height: 0.5mm; Depth: 1.25mm; Case Code (Imperial): 0805; Lead Free: LeadFree; Military Standard: Not; Package Description: 2-Pin Surface Mounted Device, Body 2 x 1.25 mm; Case Code (Metric): 2012; Composition: ThickFilm; Voltage Rating: 150V; Manufacturer URL: http://www.yageo.com/; Packaging: TapeandReel; Package Reference: 0805; REACH SVHC: Unknown; Tolerance: 5%; Case/Package: 0805; Max Operating Temperature: 155degC; Number of Pins: 2; Min Operating Temperature: -55degC; RoHSCompliant: true; Length: 2mm; Datasheet URL: http://www.yageo.com/NewPortal/yageodocoutput?fileName=/pdf/R-Chip/PYu-RC_Group_51_RoHS_L_5.pdf; Termination: SMD/SMT; Radiation Hardening: No; Width: 1.25mm; Contact Plating: Tin; Datasheet Version: Rev. 5, 10/2016
R?#3 R?#4 = CMP-03412-013102-1: as R5 on sheet Output; Lead Free: Yes; Package: RL2512; Temperature Range High: +155°C; Octopart: https://octopart.com/rl2512fk-070r1l-yageo-42334369; Composition: Thick Film; Height: 0.65mm; ComponentLink2URL: http://www.yageo.com/documents/recent/PYu-RL_Group_521_RoHS_L_2.pdf; Device Class L3: Chip SMD Resistors; Automotive: Yes; Series: RL; Device Class L1: Passive Components; Device Class L2: Resistors; Mouser Description: Current Sense Resistors 0.1ohm 1% 1W; Temperature: -55°C to +155°C; ComponentLink2Description: Datasheet; Footprint Url: http://www.yageo.com/exep/pages/download/literatures/PYu-R_Mount_10.pdf; Ipc Land Pattern Name: RESC635320X55; RoHS: TRUE; Category: Res; Temperature Range Low: -55°C; Power Rating: 1W; Tolerance: 1%; Resistance: 100mΩ; Digikey Description: RES 0.1 OHM 1% 1W 2512
U?#1 U?#2 = CMP-04895-000095-1: Output Current: 10mA; Accuracy: 0.1%; Mount: Surface Mount; Case/Package: VSSOP; Min Operating Temperature: -40°C; Max Operating Temperature: 125°C; RoHS Compliant: Yes; Packaging: Tape and Reel
U?#3 U?#4 = CMP-04910-000068-1: LOW IQ, IDEAL DIODE CONTROLLER; Max Operating Temperature: 125°C; Min Operating Temperature: -40°C; RoHS Compliant: Yes

## Nets that join several sheets
+3.3: MCU (19 pins), Output (34 pins), Input (8 pins)
GND: MCU (32 pins), Output (37 pins), Input (15 pins)
VCC: Output (16 pins), Input (J?.3)
ALERT1: MCU (U14.50), Input (R?#2.1 U?#2.3)
ALERT2: MCU (U14.51), Input (R?#1.1 U?#1.3)
NetU5_4: MCU (U14.8), Output (U5.4)
NetU6_4: MCU (U14.9), Output (U6.4)
NetU7_4: MCU (U14.10), Output (U7.4)
NetU8_4: MCU (U14.11), Output (U8.4)
NetU9_4: MCU (U14.24), Output (U9.4)
NetU10_4: MCU (U14.25), Output (U10.4)
NetU11_4: MCU (U14.26), Output (U11.4)
NetU12_4: MCU (U14.27), Output (U12.4)
SCL: MCU (R32.1 U14.58), Output (U13.22), Input (U?#1.5 U?#2.5)
SDA: MCU (R30.1 U14.59), Output (U13.23), Input (U?#1.4 U?#2.4)